# EAGLE design main_schotky (EAGLE 7.5.0)
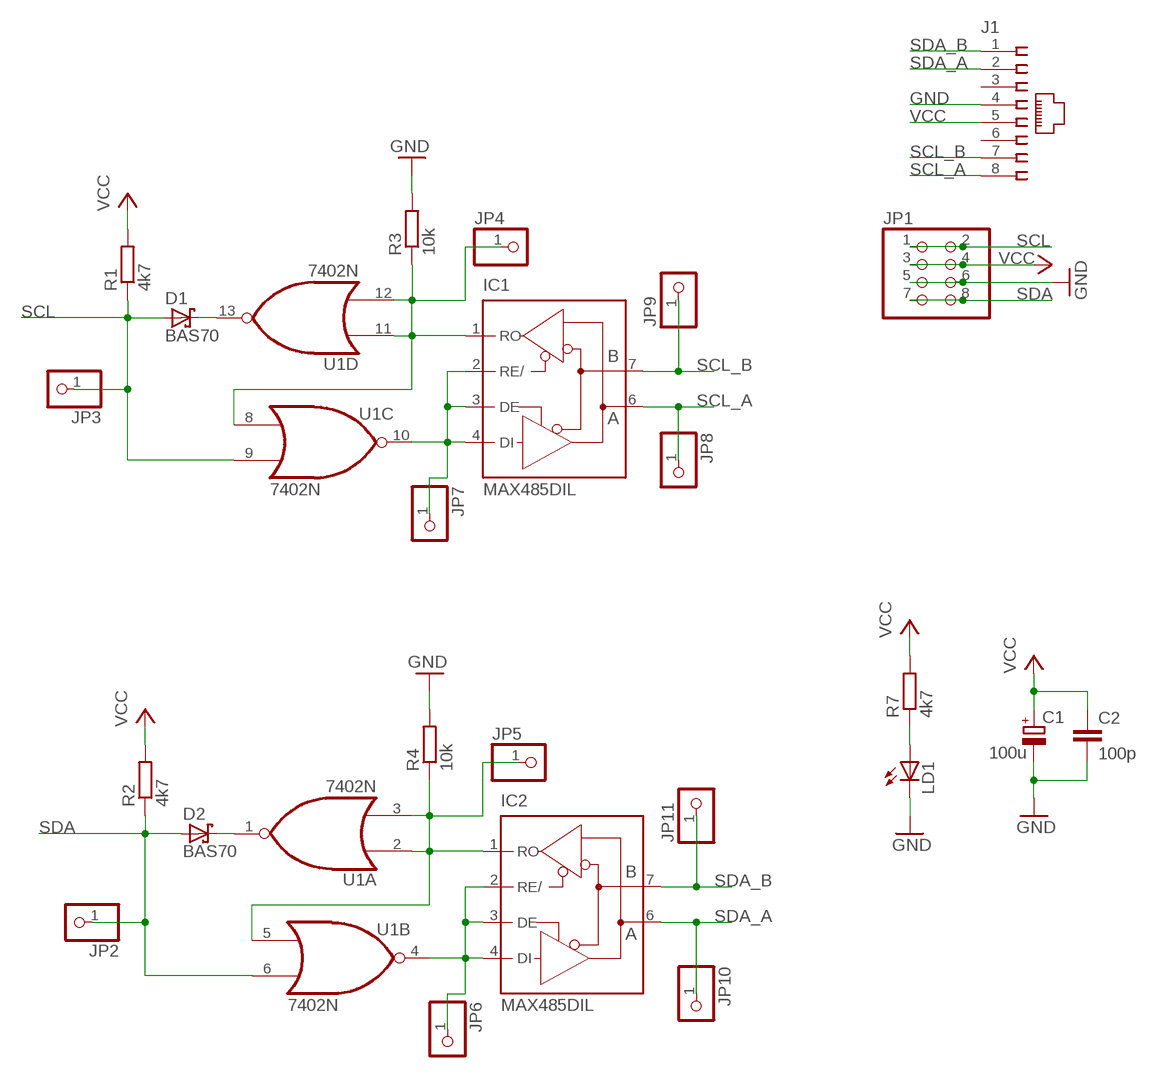
[diagram p0: schematic, sheet 1]

## Parts
C1  100u  CPOL-EUE2-4  [E2-4]
C2  100p  C-EU025-024X044  [C025-024X044]
D1  BAS70  [SOT23]
D2  BAS70  [SOT23]
IC1  MAX485DIL  [DIL08]
IC2  MAX485DIL  [DIL08]
J1  215877-4  [215877-4]
JP1  PINHD-2X4  [2X04]
JP2  PINHD-1X1/LONG  [1X01]
JP3  PINHD-1X1/LONG  [1X01]
JP4  PINHD-1X1/LONG  [1X01]
JP5  PINHD-1X1/LONG  [1X01]
JP6  PINHD-1X1/LONG  [1X01]
JP7  PINHD-1X1/LONG  [1X01]
JP8  PINHD-1X1/LONG  [1X01]
JP9  PINHD-1X1/LONG  [1X01]
JP10  PINHD-1X1/LONG  [1X01]
JP11  PINHD-1X1/LONG  [1X01]
LD1  LEDSMT1206  [1206]
R1  4k7  R-EU_R0805  [R0805]
R2  4k7  R-EU_R0805  [R0805]
R3  10k  R-EU_R0805  [R0805]
R4  10k  R-EU_R0805  [R0805]
R7  4k7  R-EU_R0805  [R0805]
U1  7402N  [DIL14]

## Nets
GND: C1.- C2.2 J1.4 JP1.5 JP1.6 LD1.C R3.2 R4.2
N$1: IC2.2(RE/) IC2.3(DE) IC2.4(DI) JP6.1 U1.4(B:O)
N$2: IC2.1(RO) JP5.1 R4.1 U1.2(A:I0) U1.3(A:I1) U1.5(B:I0)
N$3: D1.3(C) U1.13(D:O)
N$4: D2.3(C) U1.1(A:O)
N$5: LD1.A R7.1
N$6: IC1.2(RE/) IC1.3(DE) IC1.4(DI) JP7.1 U1.10(C:O)
N$7: IC1.1(RO) JP4.1 R3.1 U1.8(C:I0) U1.11(D:I0) U1.12(D:I1)
SCL: D1.1(A) JP1.1 JP1.2 JP3.1 R1.1 U1.9(C:I1)
SCL_A: IC1.6(A) J1.8 JP8.1
SCL_B: IC1.7(B) J1.7 JP9.1
SDA: D2.1(A) JP1.7 JP1.8 JP2.1 R2.1 U1.6(B:I1)
SDA_A: IC2.6(A) J1.2 JP10.1
SDA_B: IC2.7(B) J1.1 JP11.1
VCC: C1.+ C2.1 J1.5 JP1.3 JP1.4 R1.2 R2.2 R7.2
Unconnected: J1.3 J1.6

## Power pins joined to a net without a drawn wire
GND: IC1.5(GND) IC2.5(GND) U1.7(P:GND)
VCC: IC1.8(VCC) IC2.8(VCC) U1.14(P:VCC)

## Library data of the parts
C1 = resistor:CPOL-EU: POLARIZED CAPACITOR, European symbol
C2 = resistor:C-EU: CAPACITOR, European symbol
D1 D2 = diode:BAS70: Silicon Schottky Diodes General-purpose diode for high-speed switching
IC1 IC2 = maxim:MAX485: RS485 TRANSEIVER
J1 = con-amp:215877-4: AMP connector
JP1 = pinhead:PINHD-2X4: PIN HEADER
JP2-JP11 = pinhead_v2:PINHD-1X1: PIN HEADER
LD1 = led:LED: LED OSRAM: - CHIPLED LG R971, LG N971, LY N971, LG Q971, LY Q971, LO R971, LY R971 LH N974, LH R974 LS Q976, LO Q976, LY Q976 LO Q996 - Hyper CHIPLED LW Q18S LB Q993, LB Q99A, LB R99A - SideLED LS A670, LO A670, LY A670, LG A670, LP A670 LB A673, LV A673, LT A673, LW A673 LH A674 LY A675 LS A676, LA A676, LO A676, LY A676, LW A676 LS A679, LY A679, LG A679 - Hyper Micro SIDELED® LS Y876, LA Y876, LO Y876, LY Y876 LT Y87S - SmartLED LW L88C, LW L88S LB L89C, LB L89S, LG L890 LS L89K, LO L89K, LY L89K LS L896, LA L896, LO L896, LY L896 - TOPLED LS T670, LO T670, LY T670, LG T670, LP T670 LSG T670, LSP T670, LSY T670, LOP T670, LYG T670 LG T671, LOG T671, LSG T671 LB T673, LV T673, LT T673, LW T673 LH T674 LS T676, LA T676, LO T676, LY T676, LB T676, LH T676, LSB T676, LW T676 LB T67C, LV T67C, LT T67C, LS T67K, LO T67K, LY T67K, LW E67C LS E67B, LA E67B, LO E67B, LY E67B, LB E67C, LV E67C, LT E67C LW T67C LS T679, LY T679, LG T679 LS T770, LO T770, LY T770, LG T770, LP T770 LB T773, LV T773, LT T773, LW T773 LH T774 LS E675, LA E675, LY E675, LS T675 LS T776, LA T776, LO T776, LY T776, LB T776 LHGB T686 LT T68C, LB T68C - Hyper Mini TOPLED® LB M676 - Mini TOPLED Santana® LG M470 LS M47K, LO M47K, LY M47K Source: http://www.osram.convergy.de/
R1-R4 R7 = resistor:R-EU_: RESISTOR, European symbol
U1 = 74xx-us:74*02: Quad 2-input NOR gate

## Module A
Ports: AA(io) B(io)

### Library data of the parts

## Board
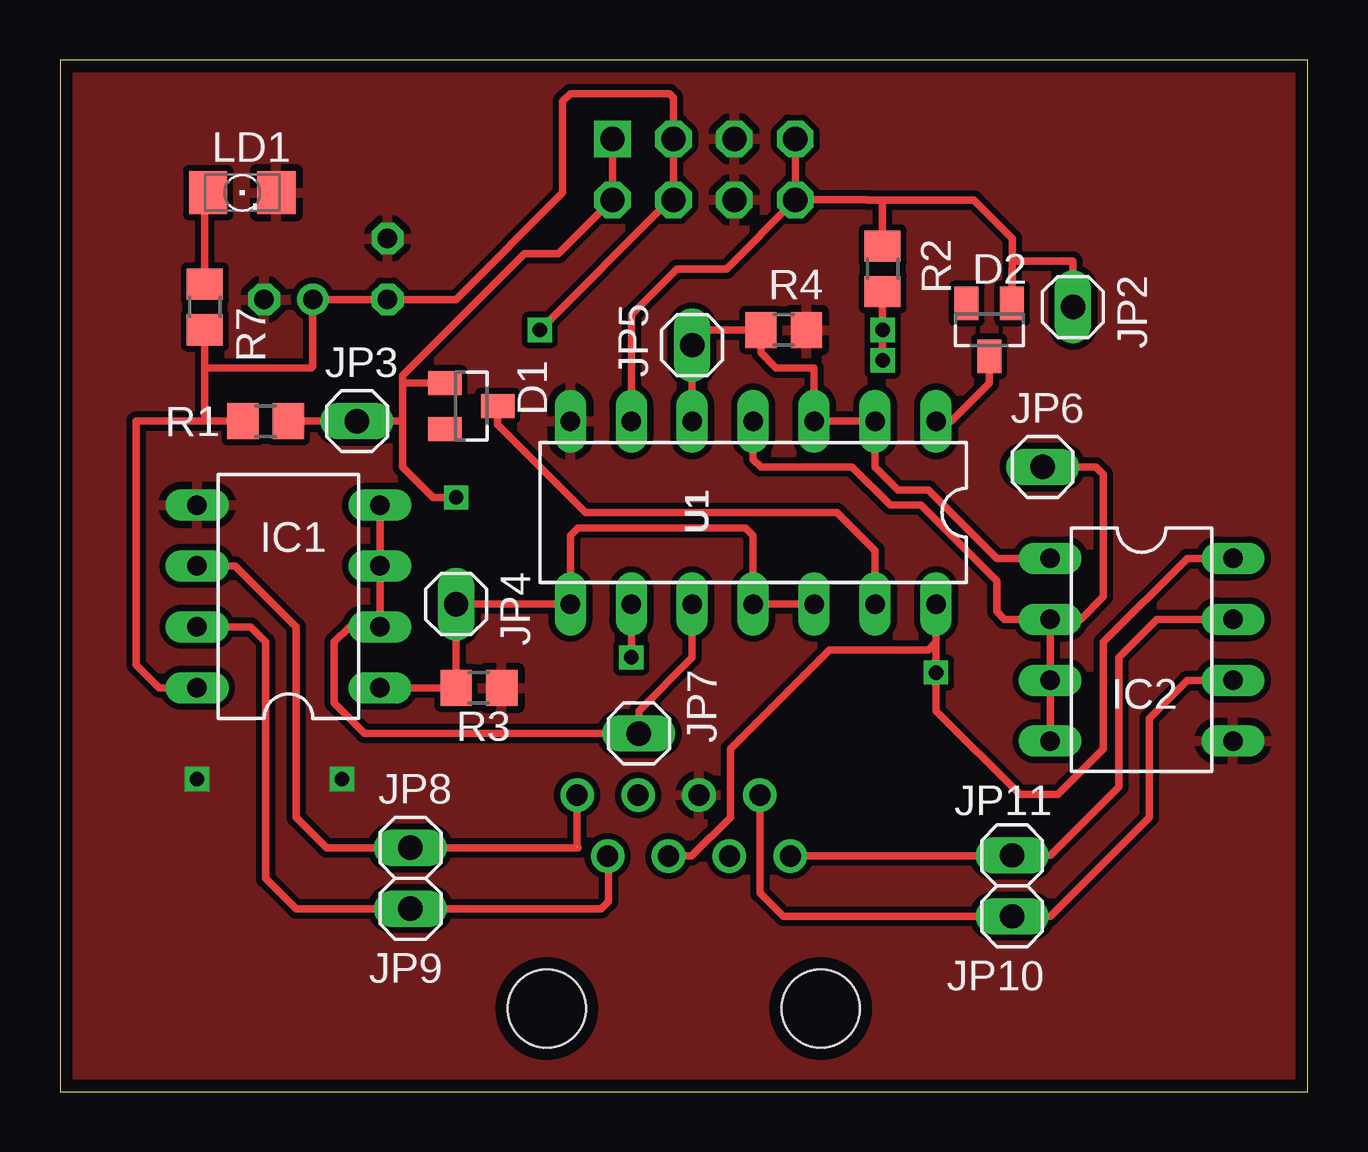
[diagram p1: board, top side]
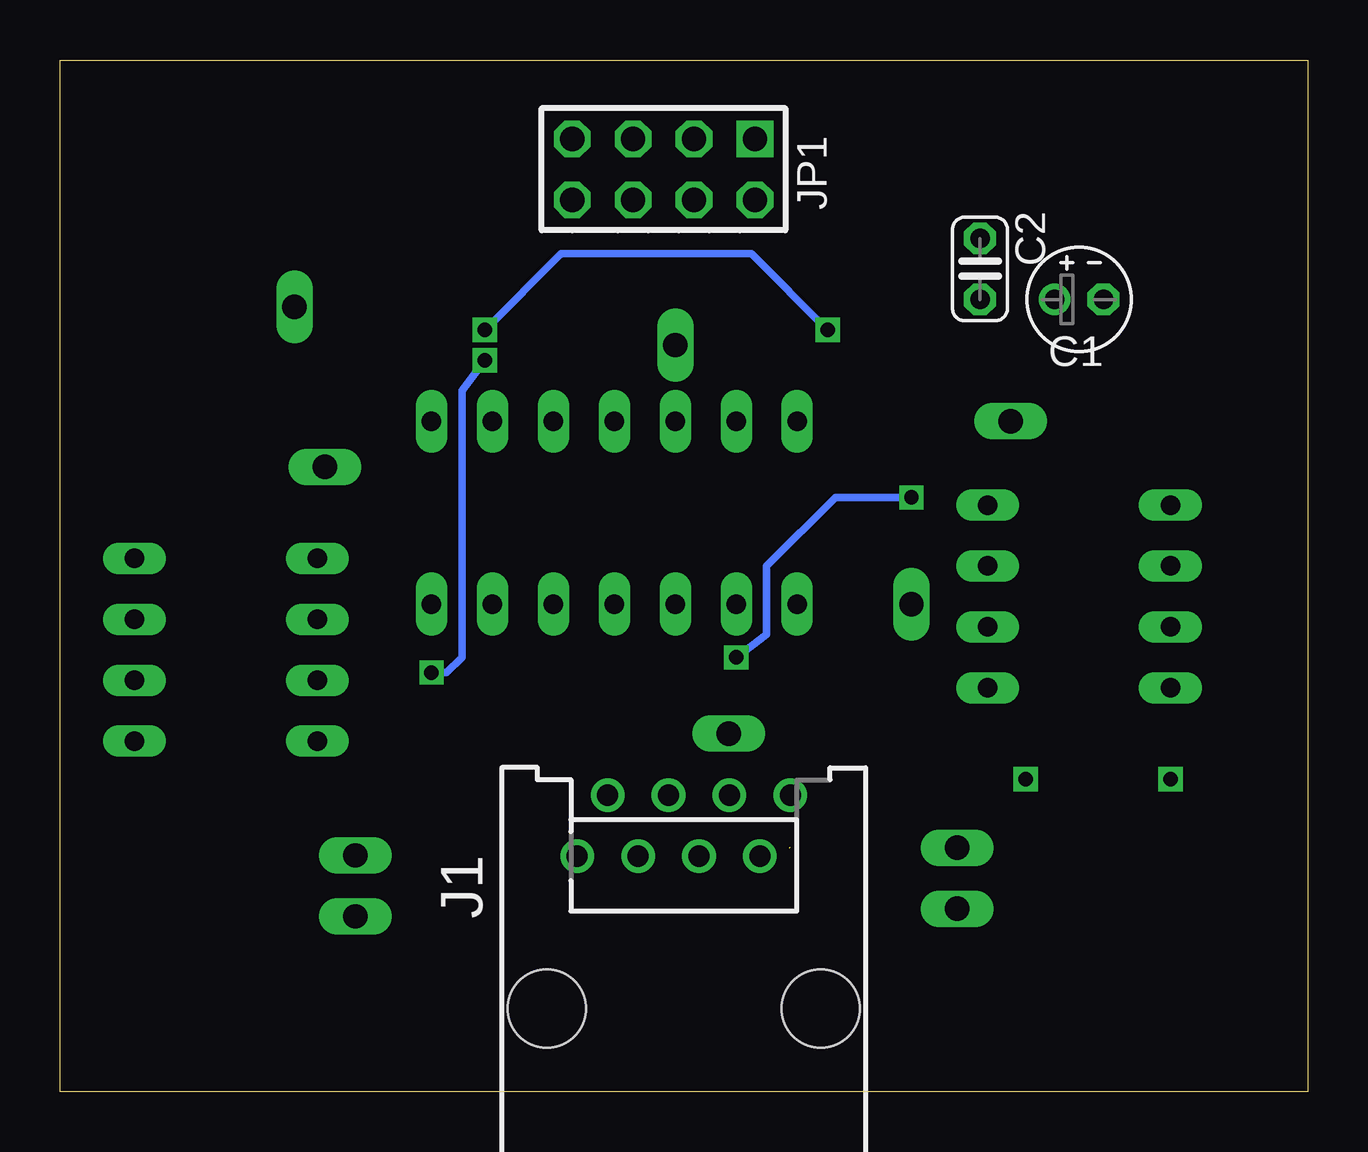
[diagram p2: board, bottom side, seen from below]

Size 52 x 43 mm. Coordinates in mm from the lower left corner, seen from the top.
Outline: 0,0 52,0 52,43 0,43 0,0
Copper layers (1*16): Top 0.035mm / dielectric 1.5mm / Bottom 0.035mm
Design rules "default *": minimum track width 10mil, minimum drill 12mil, track to track 10mil, track to pad 10mil, pad to pad 10mil, via to via 10mil, smd to smd 8mil, copper to edge 20mil, drill to drill 10mil, minimum pad ring 10mil, minimum via ring 8mil, stop-mask expansion 4mil, vias tented up to drill 0mil, thermal gap 12mil

### Footprints (pad centres in the part's own frame; a part is rotated, then mirrored left to right if it is on the bottom)
E2-4 = drill 0.813 pad 1.27: + -1.016,0 | drill 0.813 pad 1.27 octagon: - 1.016,0
C025-024X044 = drill 0.813 octagon: 1 -1.27,0; 2 1.27,0
SOT23 = smd 1 x 1.4: 1 -0.95,-1.1; 2 0.95,-1.1; 3 0,1.1
DIL08 = drill 0.813 long: 1 -3.81,-3.81; 2 -1.27,-3.81; 3 1.27,-3.81; 4 3.81,-3.81; 5 3.81,3.81; 6 1.27,3.81; 7 -1.27,3.81; 8 -3.81,3.81
215877-4 = drill 0.889: 1 -4.445,6.35; 2 -3.175,8.89; 3 -1.905,6.35; 4 -0.635,8.89; 5 0.635,6.35; 6 1.905,8.89; 7 3.175,6.35; 8 4.445,8.89 | hole 3.251: -5.715,0; 5.715,0
2X04 = drill 1.016 square: 1 -3.81,-1.27 | drill 1.016 octagon: 2 -3.81,1.27; 3 -1.27,-1.27; 4 -1.27,1.27; 5 1.27,-1.27; 6 1.27,1.27; 7 3.81,-1.27; 8 3.81,1.27
1X01 = drill 1.016 long: 1 0,0
1206 = smd 1.6 x 1.803: A -1.422,0; C 1.422,0
R0805 = smd 1.3 x 1.5: 1 -0.95,0; 2 0.95,0
DIL14 = drill 0.813 long: 1 -7.62,-3.81; 2 -5.08,-3.81; 3 -2.54,-3.81; 4 0,-3.81; 5 2.54,-3.81; 6 5.08,-3.81; 7 7.62,-3.81; 8 7.62,3.81; 9 5.08,3.81; 10 2.54,3.81; 11 0,3.81; 12 -2.54,3.81; 13 -5.08,3.81; 14 -7.62,3.81

### Placement (x,y rotation side)
C1  9.53,33.02 0 bottom
C2  13.65,34.29 90 bottom
D1  17.14,28.57 270 top
D2  38.73,31.75 180 top
IC1  9.53,20.64 90 top
IC2  45.09,18.41 270 top
J1  26,3.46 0 bottom
JP1  26.84,38.44 180 bottom
JP2  42.23,32.7 270 top
JP3  12.38,27.94 0 top
JP4  16.51,20.32 270 top
JP5  26.35,31.11 90 top
JP6  40.96,26.04 0 top
JP7  24.13,14.92 0 top
JP8  14.61,10.16 0 top
JP9  14.61,7.62 180 top
JP10  39.69,7.3 180 top
JP11  39.69,9.84 180 top
LD1  7.6,37.47 0 top
R1  8.57,27.94 180 top
R2  34.29,34.29 270 top
R3  17.46,16.83 0 top
R4  30.16,31.75 0 top
R7  6.03,32.7 270 top
U1  28.89,24.13 180 top

### Tracks (layer width: path | path; a pad name or v marks a point on that pad's centre or on a via)
GND  (via drill 0.6 pad 1.02)
  other vias: 5.71,13.02 11.75,13.02
  pour Top: -4.76,-2.86 -4.76,67.94 72.71,67.94 72.71,-5.08 -4.76,-5.08 -4.76,-3.17
N$1
  Top 0.305: U1.4 28.89,26.35 29.21,26.04 33.02,26.04 34.61,24.45 35.88,24.45 39.05,21.27 39.05,20 39.37,19.68 IC2.2 | IC2.4 IC2.3 IC2.2 | JP6.1 43.18,26.04 43.5,25.72 43.5,20.64 42.55,19.68 IC2.2
N$2
  Top 0.305: U1.5 JP5.1 26.67,31.75 R4.1 29.21,30.8 29.84,30.16 31.43,30.16 U1.3 U1.2 33.97,26.04 34.92,25.08 36.2,25.08 39.05,22.23 IC2.1
N$3
  Top 0.305: U1.13 33.97,22.54 32.38,24.13 21.91,24.13 18.25,27.79 D1.3
N$4
  Top 0.305: U1.1 37.15,27.94 38.73,29.53 D2.3
N$5
  Top 0.305: R7.1 6.03,37.32 LD1.A
N$6
  Top 0.305: IC1.4 IC1.3 IC1.2 12.06,19.37 11.43,18.73 11.43,16.19 12.7,14.92 JP7.1 24.13,15.88 26.35,18.1 U1.10
N$7
  Top 0.305: U1.12 U1.11 28.89,23.18 28.57,23.5 21.59,23.5 21.27,23.18 U1.8 | U1.8 21.27,19.37 | IC1.1 R3.1 16.51,20.64 JP4.1 U1.8
SCL  (via drill 0.6)
  Top 0.305: R1.1 JP3.1 14.29,27.94 | 14.29,27.94 14.29,26.04 15.56,24.77 v16.51,24.77 | 14.29,29.53 14.29,27.94 | D1.1 14.29,29.52 14.29,29.53 | 14.29,29.53 14.29,29.84 19.37,34.92 20.79,34.92 JP1.2 JP1.1 | v23.81,18.1 U1.9
  Bottom 0.305: v16.51,24.77 19.68,24.77 22.54,21.91 22.54,19.05 v23.81,18.1
SCL_A  (1 unrouted)
  Top 0.305: IC1.6 7.3,21.91 9.84,19.37 9.84,11.43 11.11,10.16 JP8.1 21.59,10.16 | J1.8 21.55,10.2
SCL_B
  Top 0.305: IC1.7 7.94,19.37 8.57,18.73 8.57,8.89 9.84,7.62 JP9.1 22.54,7.62 22.86,7.94 22.86,9.78 J1.7
SDA
  Top 0.305: U1.6 23.81,32.38 25.72,34.29 27.77,34.29 JP1.8 | JP1.8 JP1.7 | JP1.8 33.63,37.17 33.66,37.15 34.29,37.15 | 34.29,37.15 R2.1 | D2.1 39.69,33.66 | 39.69,33.66 39.69,34.29 | 34.29,37.15 38.1,37.15 39.69,35.56 39.69,34.61 | 39.69,34.61 39.69,33.66 | JP2.1 42.23,34.61 39.69,34.61
SDA_A
  Top 0.305: IC2.6 46.99,17.14 45.4,15.56 45.4,11.43 41.27,7.3 JP10.1 33.97,7.3 33.34,7.3 30.16,7.3 29.18,8.29 J1.2
SDA_B
  Top 0.305: J1.1 39.66,9.81 JP11.1 41.27,9.84 44.13,12.7 44.13,18.1 45.72,19.68 IC2.7
VCC  (via drill 0.6)
  Top 0.305: IC1.8 4.13,16.83 3.17,17.78 3.17,27.94 6.03,27.94 | 6.03,27.94 R1.2 | 6.03,30.16 6.03,27.94 | 6.03,30.16 10.48,30.16 10.54,30.23 C1.+ C2.1 16.51,33.02 20.95,37.47 20.95,41.27 21.27,41.59 25.4,41.59 25.57,41.42 JP1.3 JP1.4 25.57,37 25.25,37 v20,31.75 | v34.29,30.48 v34.29,31.75 R2.2 | IC2.8 46.99,22.23 43.5,18.73 43.5,14.29 41.59,12.38 40.01,12.38 36.51,15.88 v36.51,17.46 U1.14 36.51,18.73 36.2,18.41 32.07,18.41 27.94,14.29 27.94,11.43 26.32,9.81 J1.5 | 6.03,30.16 R7.2
  Bottom 0.305: v34.29,31.75 31.11,34.92 23.18,34.92 v20,31.75 | v36.51,17.46 35.88,17.46 35.24,18.1 35.24,29.21 v34.29,30.48